# Altium schematic sheet Sheet1.SchDoc
size A4; SheetNumber: 2; SheetTotal: 1
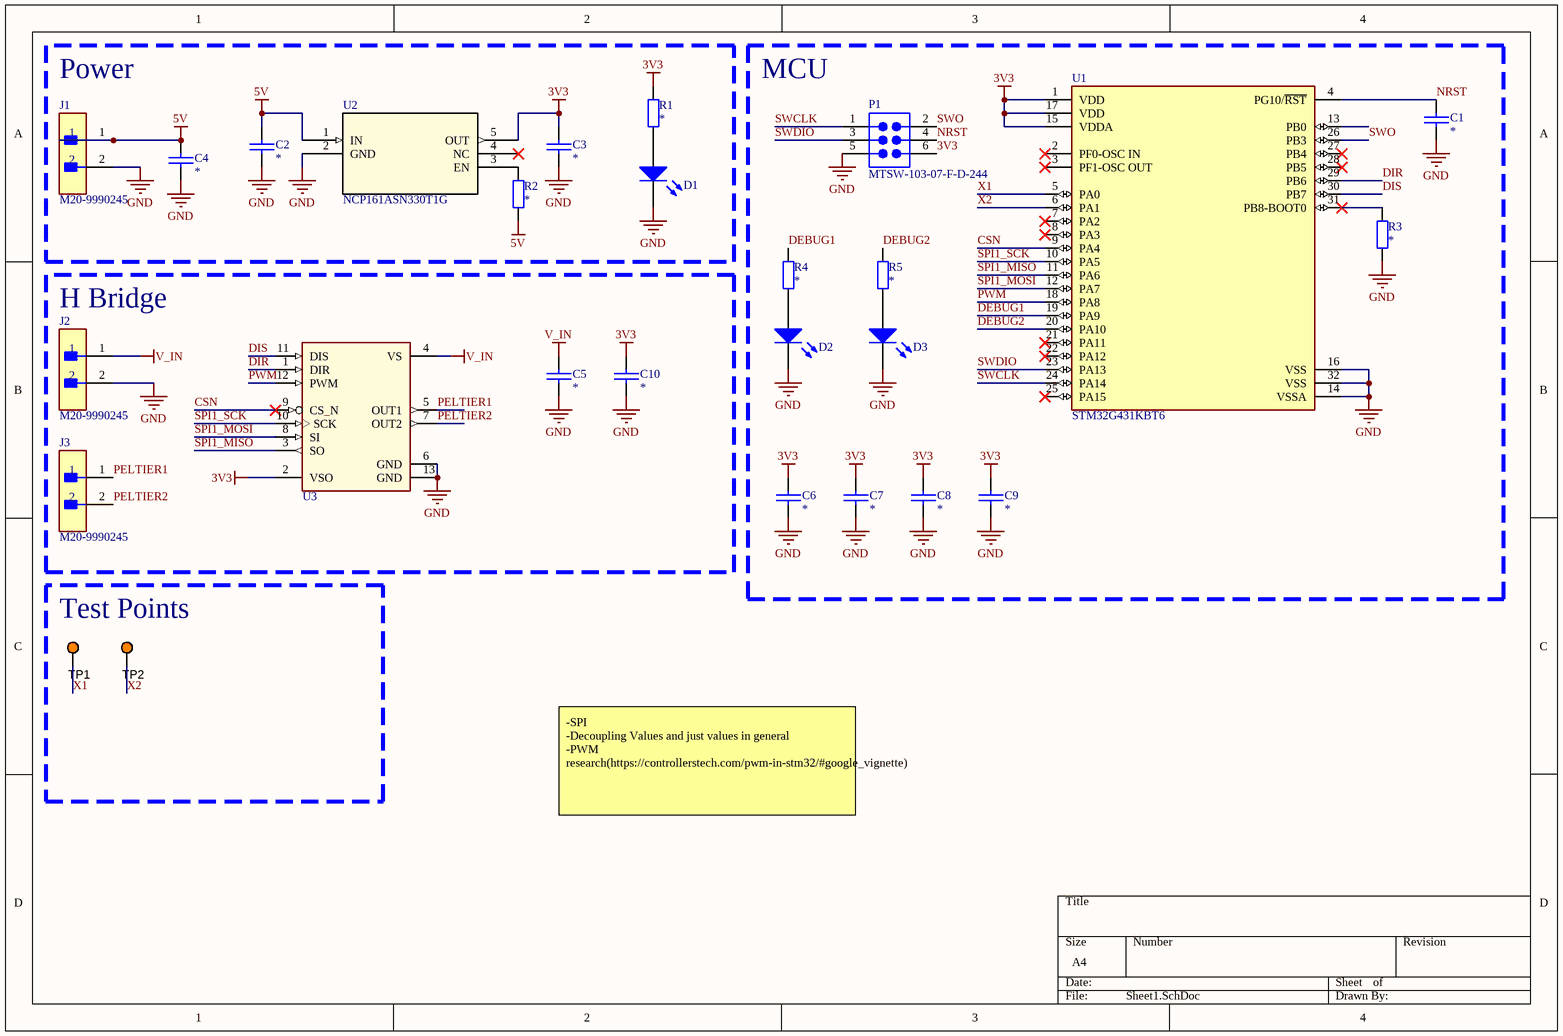
[diagram p0: Sheet1.SchDoc]

## Parts
C1  *  [0805 CAP]
C2  *  [0805 CAP]
C3  *  [0805 CAP]
C4  *  [0805 CAP]
C5  *  [0805 CAP]
C6  *  [0805 CAP]
C7  *  [0805 CAP]
C8  *  [0805 CAP]
C9  *  [0805 CAP]
C10  *  [0805 CAP]
D1  LTST-C170KGKT  [0805 LED]  (value not drawn)
D2  LTST-C170KGKT  [0805 LED]  (value not drawn)
D3  LTST-C170KGKT  [0805 LED]  (value not drawn)
J1  M20-9990245  [FP-M20-9990245-MFG]
J2  M20-9990245  [FP-M20-9990245-MFG]
J3  M20-9990245  [FP-M20-9990245-MFG]
P1  MTSW-103-07-F-D-244  [SMTC-MTSW-103-07-X-D-244]
R1  *  [0805 RES]
R2  *  [0805 RES]
R3  *  [0805 RES]
R4  *  [0805 RES]
R5  *  [0805 RES]
TP1  5003  [TP_TH]  (value not drawn)
TP2  5003  [TP_TH]  (value not drawn)
U1  STM32G431KBT6  [FP-LQFP32-5V-IPC_B]
U2  NCP161ASN330T1G  [SOT23_527AH_ONS]
U3  IFX9201SG  [SOP100P1030X260-13N]  (value not drawn)

## Blocks framed on the sheet
Power: C2-C4 D1 J1 R1 R2 U2
MCU: C1 C6-C9 D2 D3 P1 R3-R5 U1
H Bridge: C5 C10 J2 J3 U3
Test Points: TP1 TP2

## Nets
3V3: C3.1 C6.1 C7.1 C8.1 C9.1 C10.1 P1.6 R1.1 U1.1(VDD) U1.15(VDDA) U1.17(VDD) U2.5(OUT) U3.2(VSO)
5V: C2.1 C4.1 J1.1 R2.2 U2.1(IN)
GND: C1.2 C2.2 C3.2 C4.2 C5.2 C6.2 C7.2 C8.2 C9.2 C10.2 D1.2(K) D2.2(K) D3.2(K) J1.2 J2.2 P1.5 R3.2 U1.14(VSSA) U1.16(VSS) U1.32(VSS) U2.2(GND) U3.6(GND) U3.13(GND)
V_IN: C5.1 J2.1 U3.4(VS)
CSN: U1.9(PA4) U3.9(CS_N)
DEBUG1: R4.1 U1.19(PA9)
DEBUG2: R5.1 U1.20(PA10)
DIR: U1.29(PB6) U3.1(DIR)
DIS: U1.30(PB7) U3.11(DIS)
NRST: C1.1 P1.4 U1.4(PG10/~{RST})
PELTIER1: J3.1 U3.5(OUT1)
PELTIER2: J3.2 U3.7(OUT2)
PWM: U1.18(PA8) U3.12(PWM)
SPI1_MISO: U1.11(PA6) U3.3(SO)
SPI1_MOSI: U1.12(PA7) U3.8(SI)
SPI1_SCK: U1.10(PA5) U3.10(SCK)
SWCLK: P1.1 U1.24(PA14)
SWDIO: P1.3 U1.23(PA13)
SWO: P1.2 U1.26(PB3)
X1: TP1.1 U1.5(PA0)
X2: TP2.1 U1.6(PA1)
NetD1_1: D1.1(A) R1.2
NetD2_1: D2.1(A) R4.2
NetD3_1: D3.1(A) R5.2
NetR2_1: R2.1 U2.3(EN)
NetR3_1: R3.1 U1.31(PB8-BOOT0)

Not connected (* = marked no-connect by the designer): U1 2(PF0-OSC_IN)* 3(PF1-OSC_OUT)* 7(PA2)* 8(PA3)* 13(PB0) 21(PA11)* 22(PA12)* 25(PA15)* 27(PB4)* 28(PB5)*; U2 4(NC)*

## Notes on the sheet
- -SPI
  -Decoupling Values and just values in general
  -PWM research(https://controllerstech.com/pwm-in-stm32/#google_vignette)

## Library data of the parts
C1-C10 = CerCap_SMT_0805: SMT ceramic capacitor 0805 size; Value: *
D1-D3 = LED_SMT_0805: SMT LED 0805 size; Manufacturer: Lite-On Inc.; Color: Green; Lens Color: Colorless; Lens Transparency: Clear; Millicandela Rating: 35mcd; Lens Style/Size: Rectangle with Flat Top, 1.40mm x 1.25mm; Voltage - Forward (Vf) (Typ): 2V; Current - Test: 20mA; Viewing Angle: 130°; Wavelength - Dominant: 571nm; Wavelength - Peak: 574nm; Supplier 1: Digi-Key; Manufacturer Part Number: LTST-C170KGKT; RoHS: RoHS Compliant; Category: Optoelectronics; Stock 1: 503069; Pricing 1: 1=0.62, 10=0.459, 25=0.338, 100=0.2415, 250=0.16416, 500=0.14486, 1000=0.11347 (NZD); Packaging: Cut Tape (CT); Part Status: Active; Mounting Type: Surface Mount; Features: -; Package / Case: 0805 (2012 Metric); Size / Dimension: 2.00mm L x 1.25mm W; Height (Max): 1.10mm; ComponentLink1URL: http://optoelectronics.liteon.com/upload/download/DS22-2000-073/LTST-C170KGKT.pdf; ComponentLink1Description: http://optoelectronics.liteon.com/upload/download/DS22-2000-073/LTST-C170KGKT.pdf; Supplier Part Number 1: 160-1414-1-ND
J1-J3 = CMP-15831-000105-1: CONN HEADER VERT 2POS 2.54MM; Working Voltage: 750V; Gender: Male; Number of Poles: 2; Current Rating: 3A; Mated Stacking Heights: 16.54mm; Contact Resistance: 25mR; Connector Type: Male Pin; Insulation Resistance: 10GR; Mating Cycles: 300; Voltage: 50V; Flammability Rating: UL94 V-0; Pitch: 2.54mm; Series: M20; Number of Contacts: 2; Height: 0.12inch; Min Operating Temperature: -40°C; Contact Finish - Mating: GOLD; Number of Positions: 2; Number of Rows: 1; Packaging: Bulk; Package Quantity: 1000; Voltage Rating (AC): 750V; Current: 3A; Mount: Through Hole; Case/Package: SIL; Orientation: Straight; Contact Shape: Square; Weight: 0.25lb; Radiation Hardening: No; Fastening Type: Pull; Length: 5.08mm; Depth: 2.54mm; Contact Mating Length: 0.24inch; Housing Material: Nylon; Reach SVHC Compliant: Yes; Insulation Material: Nylon; Color: Black; Width: 0.25inch; Insulation Color: Black; Contact Material: Brass; Contact Type: Male Pin; Termination: Solder; Max Operating Temperature: 105°C; Contact Plating: Gold; Housing Color: Black; Max Current Rating: 3A; Lead Pitch: 2.54mm
P1 = CMP-1024-00098-1: Modified .025" SQ Post Header, Through-hole, Vertical, -55 to 125 degC, 2.54 mm Pitch, 6-Pin, Male, RoHS; Manufacturer: Samtec; Pitch: 2.54 mm; DatasheetVersion: F-214; Orientation: Vertical; PackageDescription: Assembly .025" [.64] SQ Post Terminal Strip; ComponentLink1Description: Manufacturer URL; ComponentLink3Description: Package Specification; PackageVersion: BI, 2/1987; ComponentLink1URL: http://www.samtec.com; PackageReference: MTSW-103-07-X-D-244; ComponentLink3URL: http://www.samtec.com/documents/webfiles/cpdf/MTSW-XXX-XX-X-X-XXXX-XX-XXX-MKT1.pdf; Temperature Range: -55 to 125 degC; Mounting Technology: Through-hole; PartNumber: MTSW-103-07-F-D-244; RoHS: True; ComponentLink2URL: http://www.samtec.com/documents/webfiles/pdf/MTSW.PDF; ComponentLink2Description: Datasheet
R1-R5 = Res_SMT_0805: 0805 resistor; Published: 8-Jun-2000; LatestRevisionDate: 17-Jul-2002; LatestRevisionNote: Re-released for DXP Platform.; PackageReference: AXIAL-0.4; Publisher: Altium Limited; Value: *; ComponentLink1Description: https://nz.mouser.com/datasheet/2/315/AOA0000C304-1149620.pdf
TP1 TP2 = TestPoint: Test Point, Orange, 1-Pin THD, RoHS; Peak Reverse Current: 600 uA; Forward Current: 3 A; Max Surge Current: 80 A; Forward Voltage: 1.08 V; Max Operating Temperature: 150 degC; PackageReference: 5003; Pins: 2; ComponentLink2URL: http://keyelco.com/userAssets/file/M65p56.pdf; PackageDescription: 1-Pin Through Hole Device, Dia 2.54 mm; Weight: 0.01 lb; Diameter: 5.3 mm; Mount: Through Hole; Package Quantity: 500; Packaging: Bulk; Min Operating Temperature: -65 degC; ComponentLink1Description: Manufacturer URL; Height: 0.25 inch; ComponentLink1URL: http://www.keyelco.com/; ComponentLink2Description: Datasheet; Width: 0.25 inch; REACH SVHC: No SVHC; RoHSCompliant: true; Radiation Hardening: No; Length: 9.5 mm; DatasheetVersion: Jun-15
U1 = CMP-12105-000140-1: IC MCU 32BIT 128KB FLASH 32LQFP
U2 = NCP161ASN330T1G: Description; Manufacturer_Name: onsemi; Copyright: Copyright (C) 2026 Ultra Librarian. All rights reserved.; Manufacturer_Part_Number: NCP161ASN330T1G; RefDes: RefDes; Type: Type
U3 = IFX9201SG: 6 A H-Bridge with SPI; Manufacturer: Infineon Technologies; ManufacturerPartNumber: IFX9201SG; PackageReference: PG-DSO-12-17